# EAGLE design W040X (EAGLE 6.6.0)
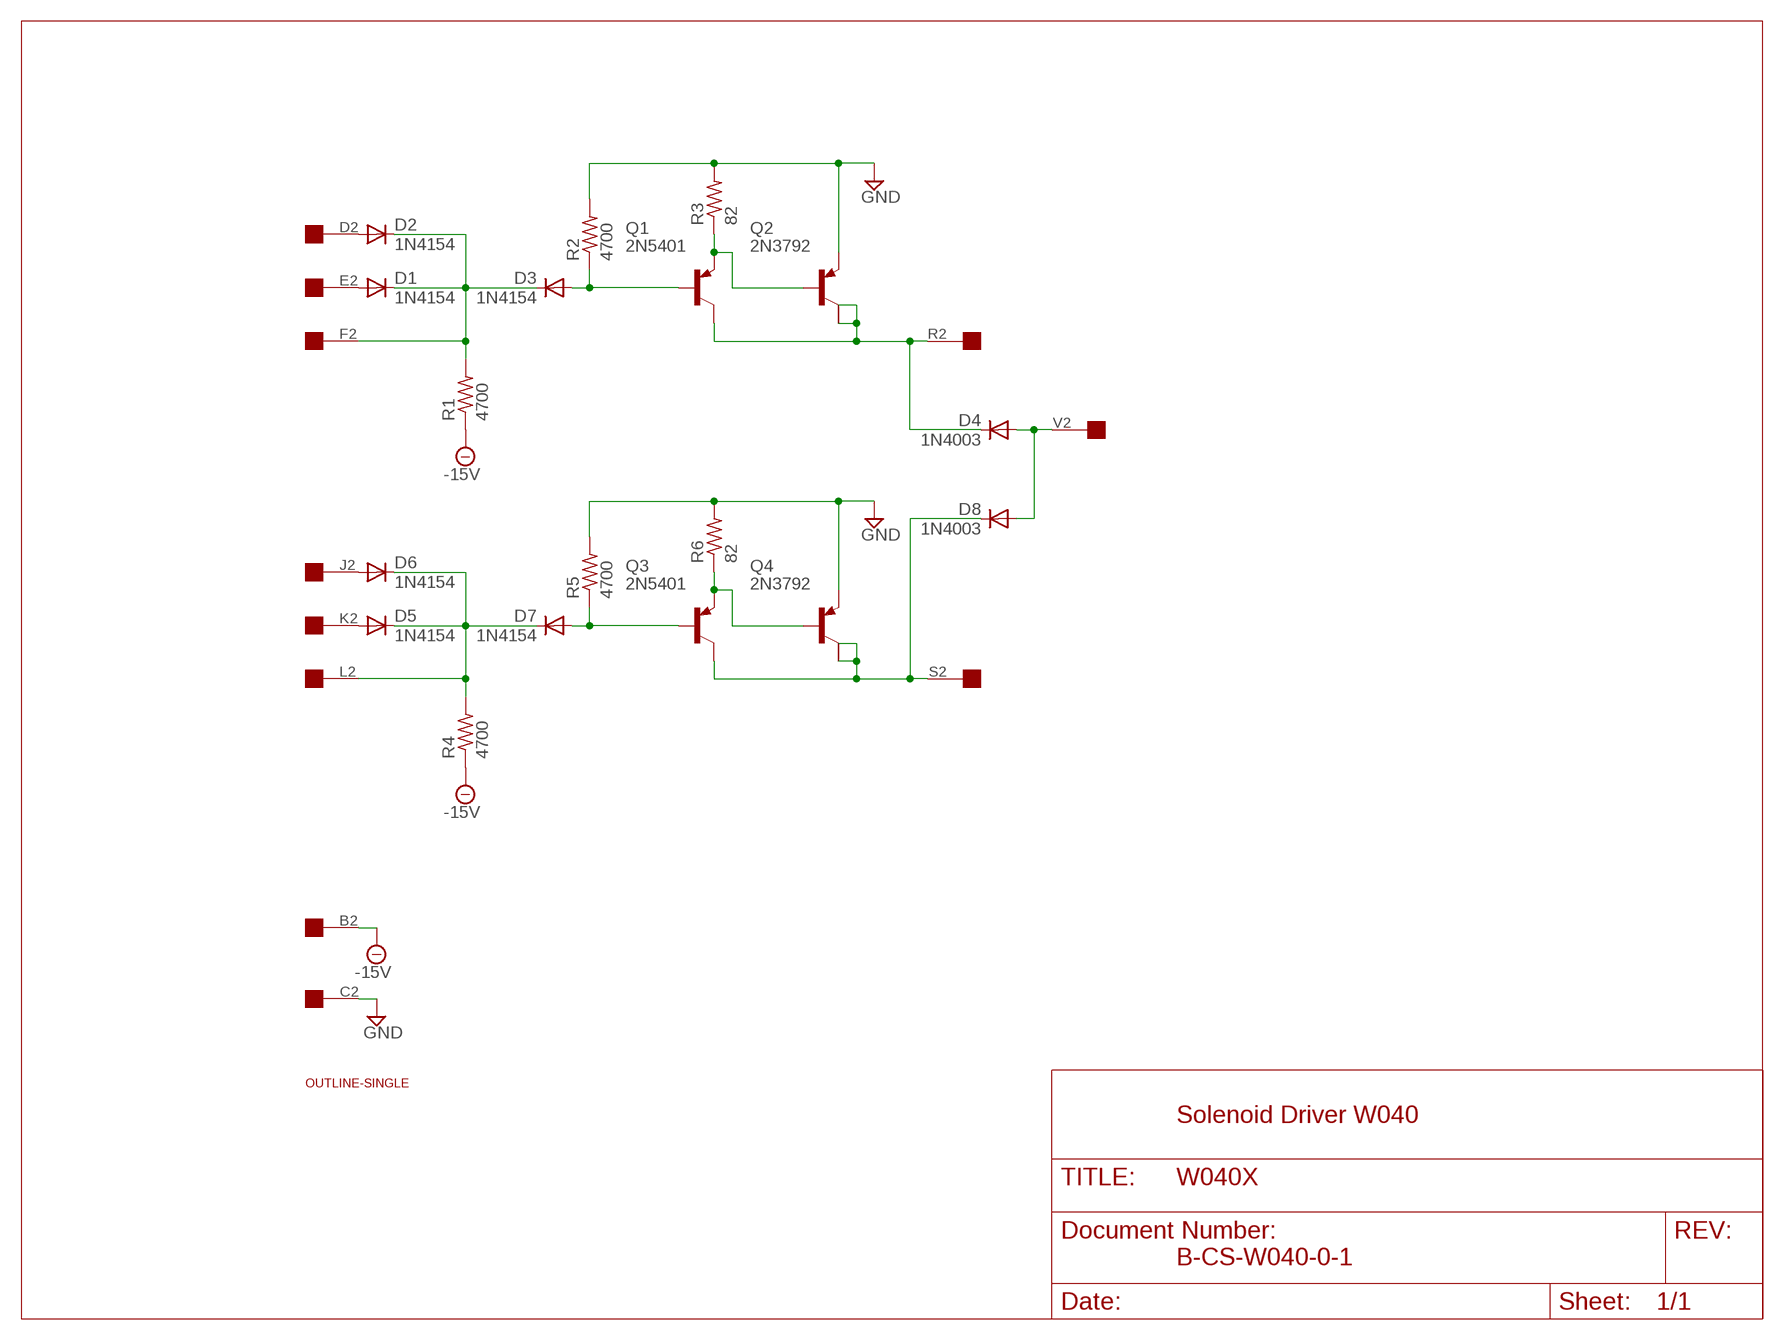
[diagram p0: schematic, sheet 1]

## Parts
D1  1N4154  1N4148  [DO35-10]
D2  1N4154  1N4148  [DO35-10]
D3  1N4154  1N4148  [DO35-10]
D4  1N4003  1N4004  [DO41-10]
D5  1N4154  1N4148  [DO35-10]
D6  1N4154  1N4148  [DO35-10]
D7  1N4154  1N4148  [DO35-10]
D8  1N4003  1N4004  [DO41-10]
Q1  2N5401  2N2904  [TO39]
Q2  2N3792  2N4902  [TO3]
Q3  2N5401  2N2904  [TO39]
Q4  2N3792  2N4902  [TO3]
R1  4700  R-US_0207/10  [0207/10]
R2  4700  R-US_0207/10  [0207/10]
R3  82  R-US_0207/10  [0207/10]
R4  4700  R-US_0207/10  [0207/10]
R5  4700  R-US_0207/10  [0207/10]
R6  82  R-US_0207/10  [0207/10]
U$1  OUTLINE-SINGLE  [SINGLE]
U$2  EDGE-1  [EDGE-CON1]

## Nets
-15V: R1.1 R4.1 U$2.B2
GND: Q2.E Q4.E R2.2 R3.2 R5.2 R6.2 U$2.C2
N$1: D1.A U$2.E2
N$2: D2.A U$2.D2
N$3: D1.C D2.C D3.C R1.2 U$2.F2
N$4: D3.A Q1.2(B) R2.1
N$5: Q1.1(E) Q2.B R3.1
N$6: D4.A D8.A U$2.V2
N$7: D4.C Q1.3(C) Q2.C Q2.C/ U$2.R2
N$8: D5.A U$2.K2
N$9: D6.A U$2.J2
N$10: D5.C D6.C D7.C R4.2 U$2.L2
N$11: D7.A Q3.2(B) R5.1
N$12: Q3.1(E) Q4.B R6.1
N$13: D8.C Q3.3(C) Q4.C Q4.C/ U$2.S2
Unconnected: U$2.A2 U$2.H2 U$2.M2 U$2.N2 U$2.P2 U$2.T2 U$2.U2

## Notes on the sheet
- Solenoid Driver W040
- B-CS-W040-0-1

## Library data of the parts
D1-D3 D5-D7 = diode:1N4148: DIODE high speed (Philips)
D4 D8 = diode:1N4004: DIODE general purpose rectifier, 1 A
Q1 Q3 = transistor-pnp:2N2904*: PNP Transistror
Q2 Q4 = transistor-pnp:2N4902: PNP Transistor
R1-R6 = rcl:R-US_: RESISTOR, American symbol
U$1 = dec-con:OUTLINE-*: Board outlines for DEC boards.
U$2 = dec-con:EDGE-1: Single-Sided DEC Edge Connector -- (side 2)

## Net classes
1 Supply: width 0.813 mm

## Board
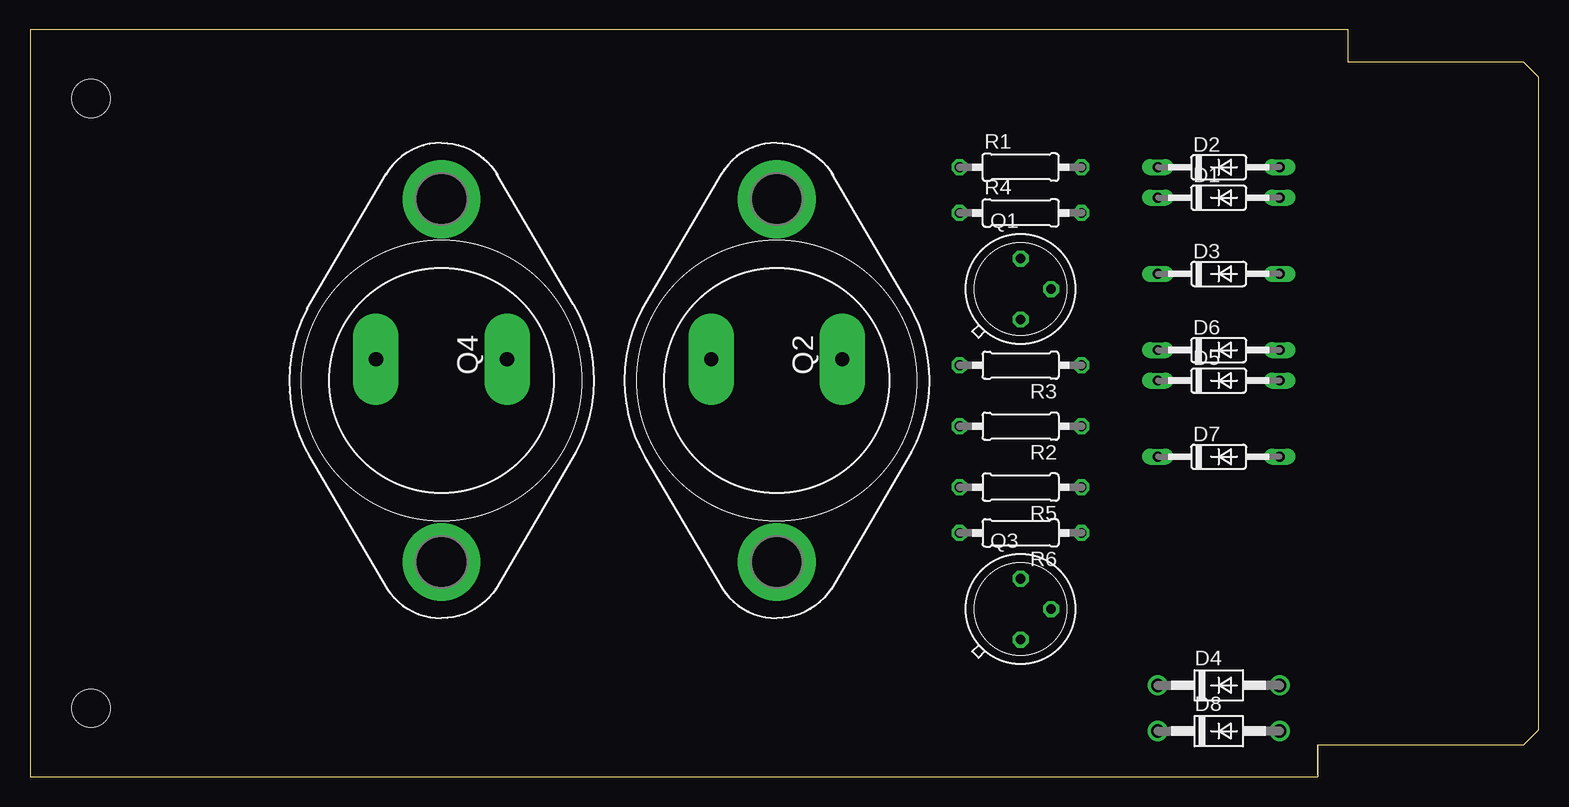
[diagram p1: board, top side]
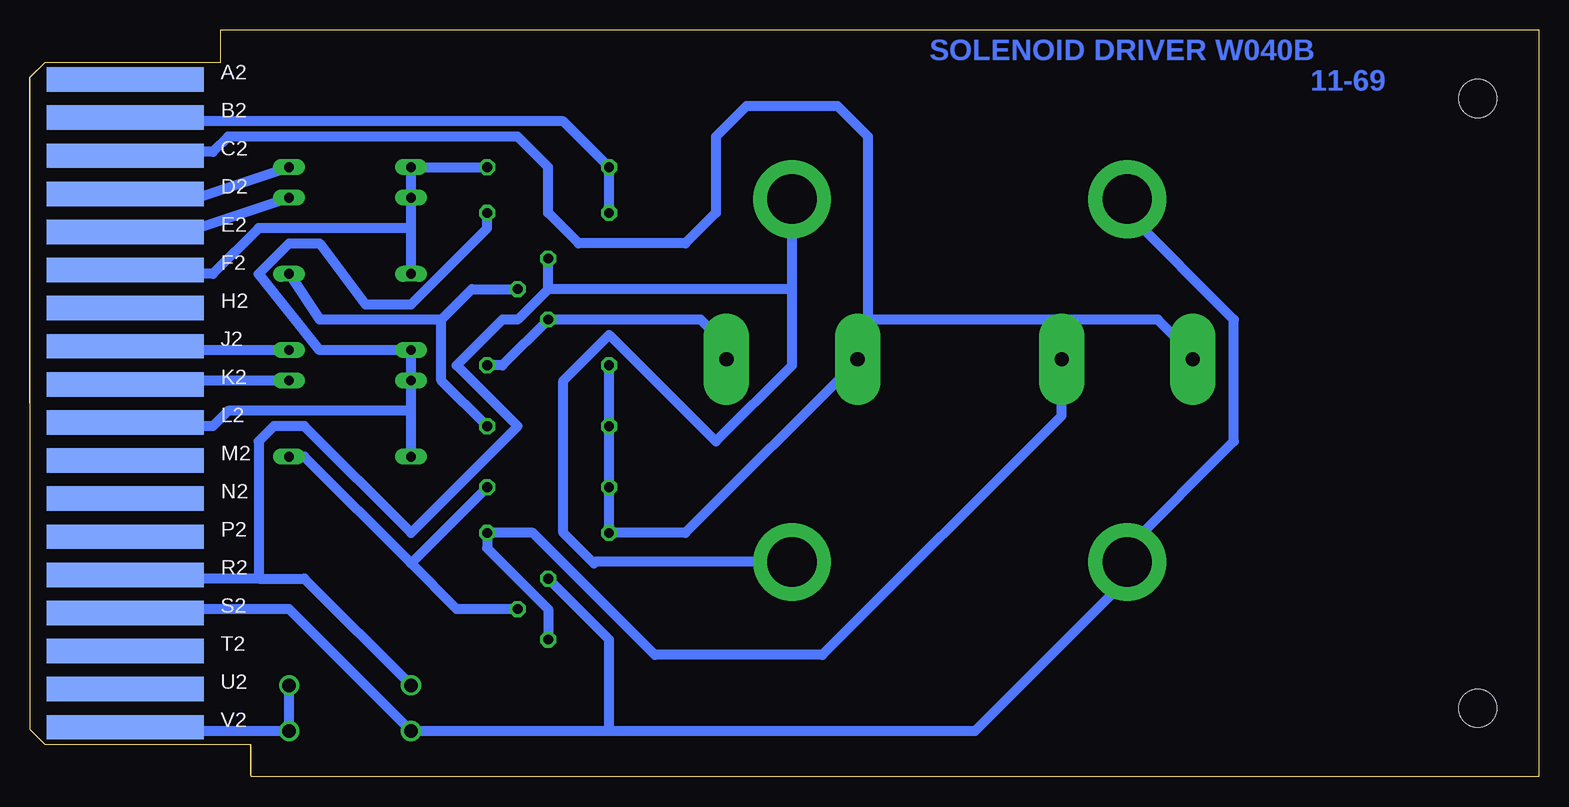
[diagram p2: board, bottom side, seen from below]

Size 125.73 x 62.23 mm. Coordinates in mm from the lower left corner, seen from the top.
Copper layers (1+16): Top 0.035mm / dielectric 1.5mm / Bottom 0.035mm
Design rules "16mils": minimum track width 16mil, minimum drill 32mil, track to track 15mil, track to pad 10mil, pad to pad 10mil, via to via 10mil, smd to smd 10mil, copper to edge 13mil, drill to drill 10mil, minimum pad ring 10mil, minimum via ring 8mil, stop-mask expansion 0mil, vias tented up to drill 0mil, thermal gap 10mil

### Footprints (pad centres in the part's own frame; a part is rotated, then mirrored left to right if it is on the bottom)
DO35-10 = drill 0.813 long: A 5.08,0; C -5.08,0
DO41-10 = drill 1.118: A 5.08,0; C -5.08,0
TO39 = drill 0.813 octagon: 1 0,-2.54; 2 2.54,0; 3 0,2.54
TO3 = drill 1.194 pad 3.81 long: B -1.778,5.461; E -1.778,-5.461 | drill 4.115 pad 6.477: C 15.113,0; C/ -15.113,0
0207/10 = drill 0.813 octagon: 1 -5.08,0; 2 5.08,0
SINGLE = hole 3.175: 120.65,56.515; 120.65,5.715
EDGE-CON1 = smd 13.106 x 2.032 bottom: A2 7.938,4.128; B2 7.938,7.303; C2 7.938,10.477; D2 7.938,13.652; E2 7.938,16.828; F2 7.938,20.003; H2 7.938,23.177; J2 7.938,26.352; K2 7.938,29.527; L2 7.938,32.703; M2 7.938,35.877; N2 7.938,39.053; P2 7.938,42.227; R2 7.938,45.403; S2 7.938,48.578; T2 7.938,51.752; U2 7.938,54.928; V2 7.938,58.102

### Placement (x,y rotation side)
D1  99.06,48.26 0 top
D2  99.06,50.8 0 top
D3  99.06,41.91 0 top
D4  99.06,7.62 0 top
D5  99.06,33.02 0 top
D6  99.06,35.56 0 top
D7  99.06,26.67 0 top
D8  99.06,3.81 0 top
Q1  82.55,40.64 0 top
Q2  62.23,33.02 270 top
Q3  82.55,13.97 0 top
Q4  34.29,33.02 270 top
R1  82.55,50.8 0 top
R2  82.55,29.21 180 top
R3  82.55,34.29 180 top
R4  82.55,46.99 0 top
R5  82.55,24.13 180 top
R6  82.55,20.32 180 top
U$1  125.73,62.23 180 top
U$2  125.73,62.23 180 top

### Tracks (layer width: path | path; a pad name or v marks a point on that pad's centre or on a via)
-15V
  Bottom 0.813: U$2.B2 117.13,54.9 116.84,54.61 81.28,54.61 R1.1 R4.1
GND
  Bottom 0.813: U$2.C2 117.17,51.74 116.84,52.07 110.49,52.07 109.22,53.34 85.09,53.34 82.55,50.8 82.55,46.99 80.01,44.45 71.12,44.45 68.58,46.99 68.58,53.34 66.04,55.88 58.42,55.88 55.88,53.34 55.88,38.1 | 55.88,38.1 55.88,35.56 56.77,35.18 | 56.77,35.18 Q2.E | R3.2 R2.2 R5.2 R6.2 71.12,20.32 56.77,34.67 56.77,35.18 | Q4.E 28.83,35.18 31.75,38.1 55.88,38.1
N$1
  Bottom 0.813: U$2.E2 117.17,45.39 116.84,45.72 111.76,45.72 D1.A
N$2
  Bottom 0.813: U$2.D2 117.14,48.56 116.84,48.26 111.76,48.26 D2.A
N$3
  Bottom 0.813: R1.2 D2.C D1.C 93.98,45.72 | D3.C 93.98,45.72 | U$2.F2 117.12,42.19 116.84,41.91 110.49,41.91 106.68,45.72 93.98,45.72
N$4
  Bottom 0.813: D3.A 101.6,38.1 91.44,38.1 | 91.44,38.1 88.9,40.64 Q1.2 | R2.1 91.44,33.02 91.44,38.1
N$5
  Bottom 0.813: Q2.B 67.69,35.94 69.85,38.1 Q1.1 86.36,34.29 R3.1
N$6
  Bottom 0.813: U$2.V2 117.16,4.13 116.84,3.81 D8.A D4.A
N$7
  Bottom 0.813: 82.55,40.64 Q1.3 | 62.23,40.64 82.55,40.64 | 62.23,40.64 Q2.C/ 62.23,48.26 | 102.87,16.51 D4.C | 102.87,16.51 102.88,16.52 | 106.68,16.51 106.68,27.94 105.41,29.21 102.87,29.21 93.98,20.32 85.09,29.21 90.17,34.29 86.36,38.1 85.09,38.1 82.55,40.64 | U$2.R2 117.17,16.84 116.84,16.51 106.68,16.51 | 106.68,16.51 102.87,16.51 | Q2.C 78.61,17.91 78.74,17.78 81.28,20.32 81.28,33.02 77.47,36.83 68.58,27.94 62.23,34.29 62.23,40.64
N$8
  Bottom 0.813: U$2.K2 117.14,32.72 116.84,33.02 D5.A
N$9
  Bottom 0.813: U$2.J2 117.17,35.89 116.84,35.56 D6.A
N$10
  Bottom 0.813: D7.C 93.98,30.48 | 93.98,30.48 D5.C D6.C 101.6,35.56 106.68,41.91 104.14,44.45 101.6,44.45 97.79,39.37 93.98,39.37 87.63,45.72 R4.2 | U$2.L2 117.17,29.54 116.84,29.21 110.49,29.21 109.22,30.48 93.98,30.48
N$11
  Bottom 0.813: 93.98,17.78 102.87,26.67 D7.A | Q3.2 90.17,13.97 93.98,17.78 | 93.98,17.78 R5.1
N$12
  Bottom 0.813: Q3.1 82.55,13.97 87.63,19.05 R6.1 83.82,20.32 73.66,10.16 59.69,10.16 39.75,30.1 Q4.B
N$13
  Bottom 0.813: U$2.S2 117.14,13.66 116.84,13.97 104.14,13.97 D8.C 77.47,3.81 | 77.47,3.81 77.47,11.43 Q3.3 | 77.47,3.81 46.99,3.81 34.29,16.51 Q4.C 34.29,19.05 25.4,27.94 25.4,38.1 34.29,46.99 Q4.C/

### Text on the board
Bottom: SOLENOID DRIVER W040B | 11-69